# EAGLE schematic T13_bikeseatdriver (EAGLE 7.1.0)
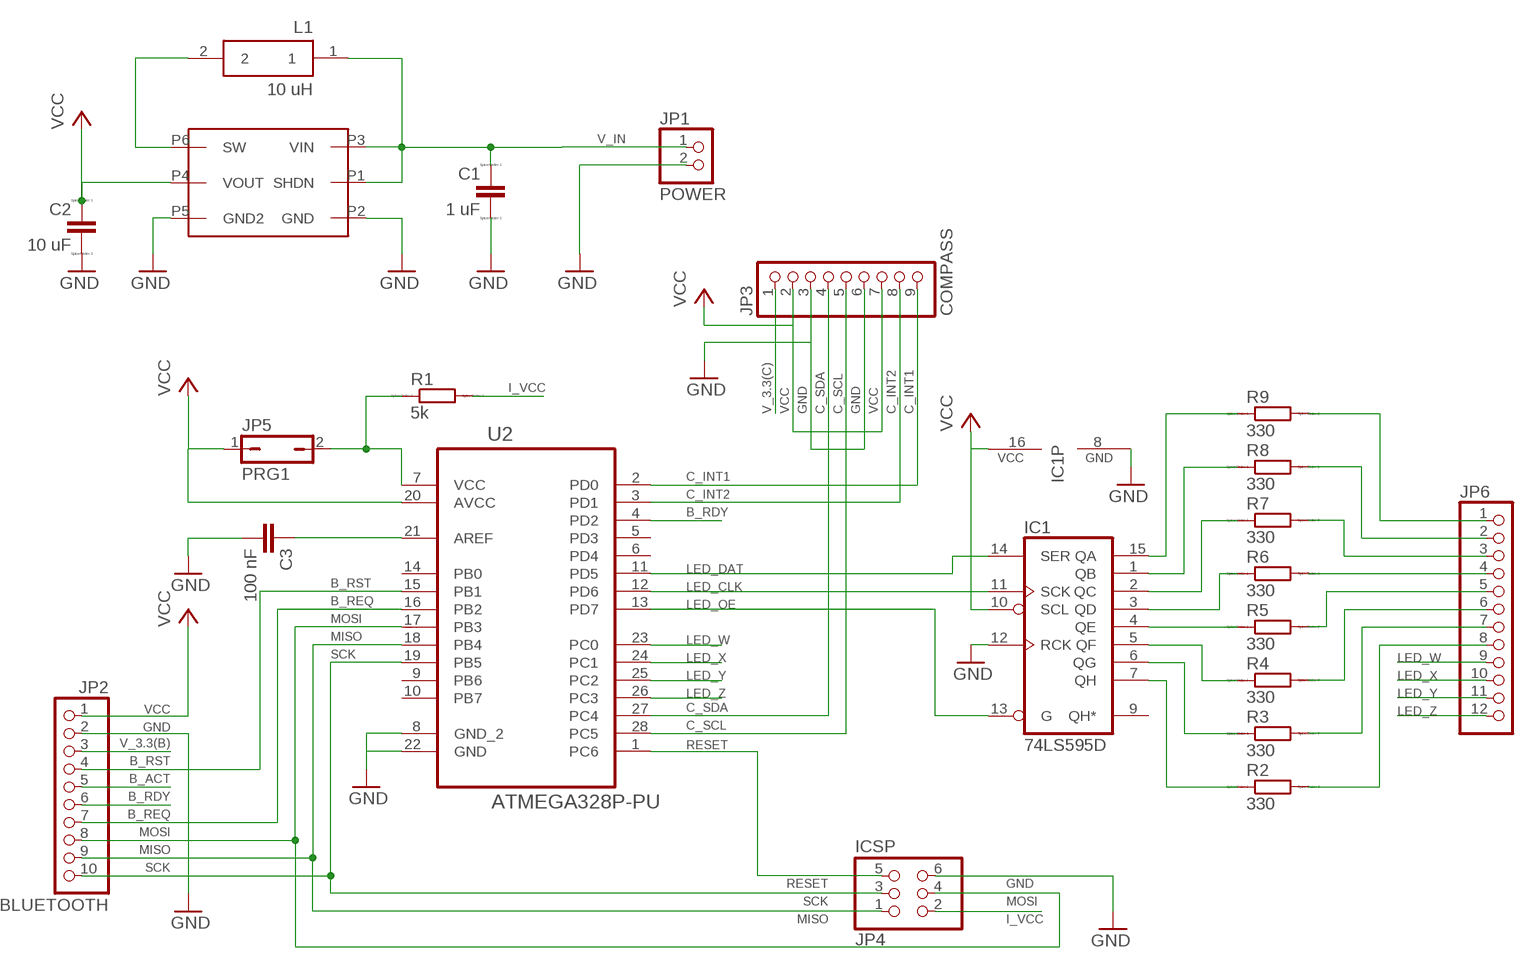
[diagram p0: schematic, sheet 1]

## Parts
C1  1 uF  CC0603  [C0603]
C2  10 uF  CC0603  [C0603]
C3  100 nF  C-EUC0603  [C0603]
IC1  74LS595D  [SO16]
JP1  POWER  PINHD-1X2  [1X02]
JP2  BLUETOOTH  PINHD-1X10  [1X10]
JP3  COMPASS  PINHD-1X9  [1X09]
JP4  ICSP  PINHD-2X3  [2X03]
JP5  PRG1  JP1Q  [JP1]
JP6  PINHD-1X12  [1X12]
L1  10 uH  SRR0603-100ML  [SRR0603]
R1  5k  RR0603  [R0603]
R2  330  RR0603  [R0603]
R3  330  RR0603  [R0603]
R4  330  RR0603  [R0603]
R5  330  RR0603  [R0603]
R6  330  RR0603  [R0603]
R7  330  RR0603  [R0603]
R8  330  RR0603  [R0603]
R9  330  RR0603  [R0603]
U2  ATMEGA328P-PU  [DIP254P762X457-28]
U$2  LTC3525  [6-LEAD-SC70]

## Nets
B_ACT: JP2.5
B_RDY: JP2.6 U2.4(PD2)
B_REQ: JP2.7 U2.16(PB2)
B_RST: JP2.4 U2.15(PB1)
C_INT1: JP3.9 U2.2(PD0)
C_INT2: JP3.8 U2.3(PD1)
C_SCL: JP3.5 U2.28(PC5)
C_SDA: JP3.4 U2.27(PC4)
GND: C1.2 C2.2 C3.2 IC1.8(GND) IC1.12(RCK) JP1.2 JP2.2 JP3.3 JP3.6 JP4.6 U2.8(GND_2) U2.22(GND) U$2.P2(GND) U$2.P5(GND2)
I_VCC: JP4.2 R1.2
LED_CLK: IC1.11(SCK) U2.12(PD6)
LED_DAT: IC1.14(SER) U2.11(PD5)
LED_OE: IC1.13(G) U2.13(PD7)
LED_W: JP6.9 U2.23(PC0)
LED_X: JP6.10 U2.24(PC1)
LED_Y: JP6.11 U2.25(PC2)
LED_Z: JP6.12 U2.26(PC3)
MISO: JP2.9 JP4.1 U2.18(PB4)
MOSI: JP2.8 JP4.4 U2.17(PB3)
N$1: C3.1 U2.21(AREF)
N$2: L1.2 U$2.P6(SW)
N$3: JP5.2 R1.1 U2.7(VCC)
N$4: IC1.7(QH) R2.1
N$5: IC1.6(QG) R3.1
N$6: IC1.5(QF) R4.1
N$7: IC1.4(QE) R5.1
N$8: IC1.3(QD) R6.1
N$9: IC1.2(QC) R7.1
N$10: IC1.1(QB) R8.1
N$11: IC1.15(QA) R9.1
N$12: JP6.1 R9.2
N$13: JP6.2 R8.2
N$14: JP6.3 R7.2
N$15: JP6.4 R6.2
N$16: JP6.5 R5.2
N$17: JP6.6 R4.2
N$18: JP6.7 R3.2
N$19: JP6.8 R2.2
RESET: JP4.5 U2.1(PC6)
SCK: JP2.10 JP4.3 U2.19(PB5)
V_3.3(B): JP2.3
V_3.3(C): JP3.1
V_IN: C1.1 JP1.1 L1.1 U$2.P1(SHDN) U$2.P3(VIN)
VCC: C2.1 IC1.10(SCL) IC1.16(VCC) JP2.1 JP3.2 JP3.7 JP5.1 U2.20(AVCC) U$2.P4(VOUT)
Unconnected: IC1.9(QH*) U2.5(PD3) U2.6(PD4) U2.9(PB6) U2.10(PB7) U2.14(PB0)

## Library data of the parts
C1 C2 = eagle-ltspice:C: CAPACITOR, European symbol; SPICEMODEL: NONE; SPICEPREFIX: C
C3 = rcl:C-EU: CAPACITOR, European symbol
IC1 = 74xx-us:74*595: 8-bit SHIFT REGISTER, output latch
JP1 = pinhead:PINHD-1X2: PIN HEADER
JP2 = pinhead:PINHD-1X10: PIN HEADER
JP3 = pinhead:PINHD-1X9: PIN HEADER
JP4 = pinhead:PINHD-2X3: PIN HEADER
JP5 = jumper:JP1Q: JUMPER
JP6 = pinhead:PINHD-1X12: PIN HEADER
L1 = Steve:SRR0603-100ML: FIXED IND 10UH 1.1A 120 MOHM SMD
R1-R9 = eagle-ltspice:R: RESISTOR, European symbol; SPICEMODEL: NONE; SPICEPREFIX: R
U2 = Atmel_By_element14_Batch_1-00:ATMEGA328P-PU: 8-bit Microcontroller with In-System Programmable Flash; MPN: ATMEGA328P-PU; OC_FARNELL: 1715487; OC_NEWARK: 15R0268; PACKAGE: PDIP-28; SUPPLIER: Atmel
U$2 = TSlib:LTC3525